# EAGLE schematic atmega8-evm-main (EAGLE 6.4)
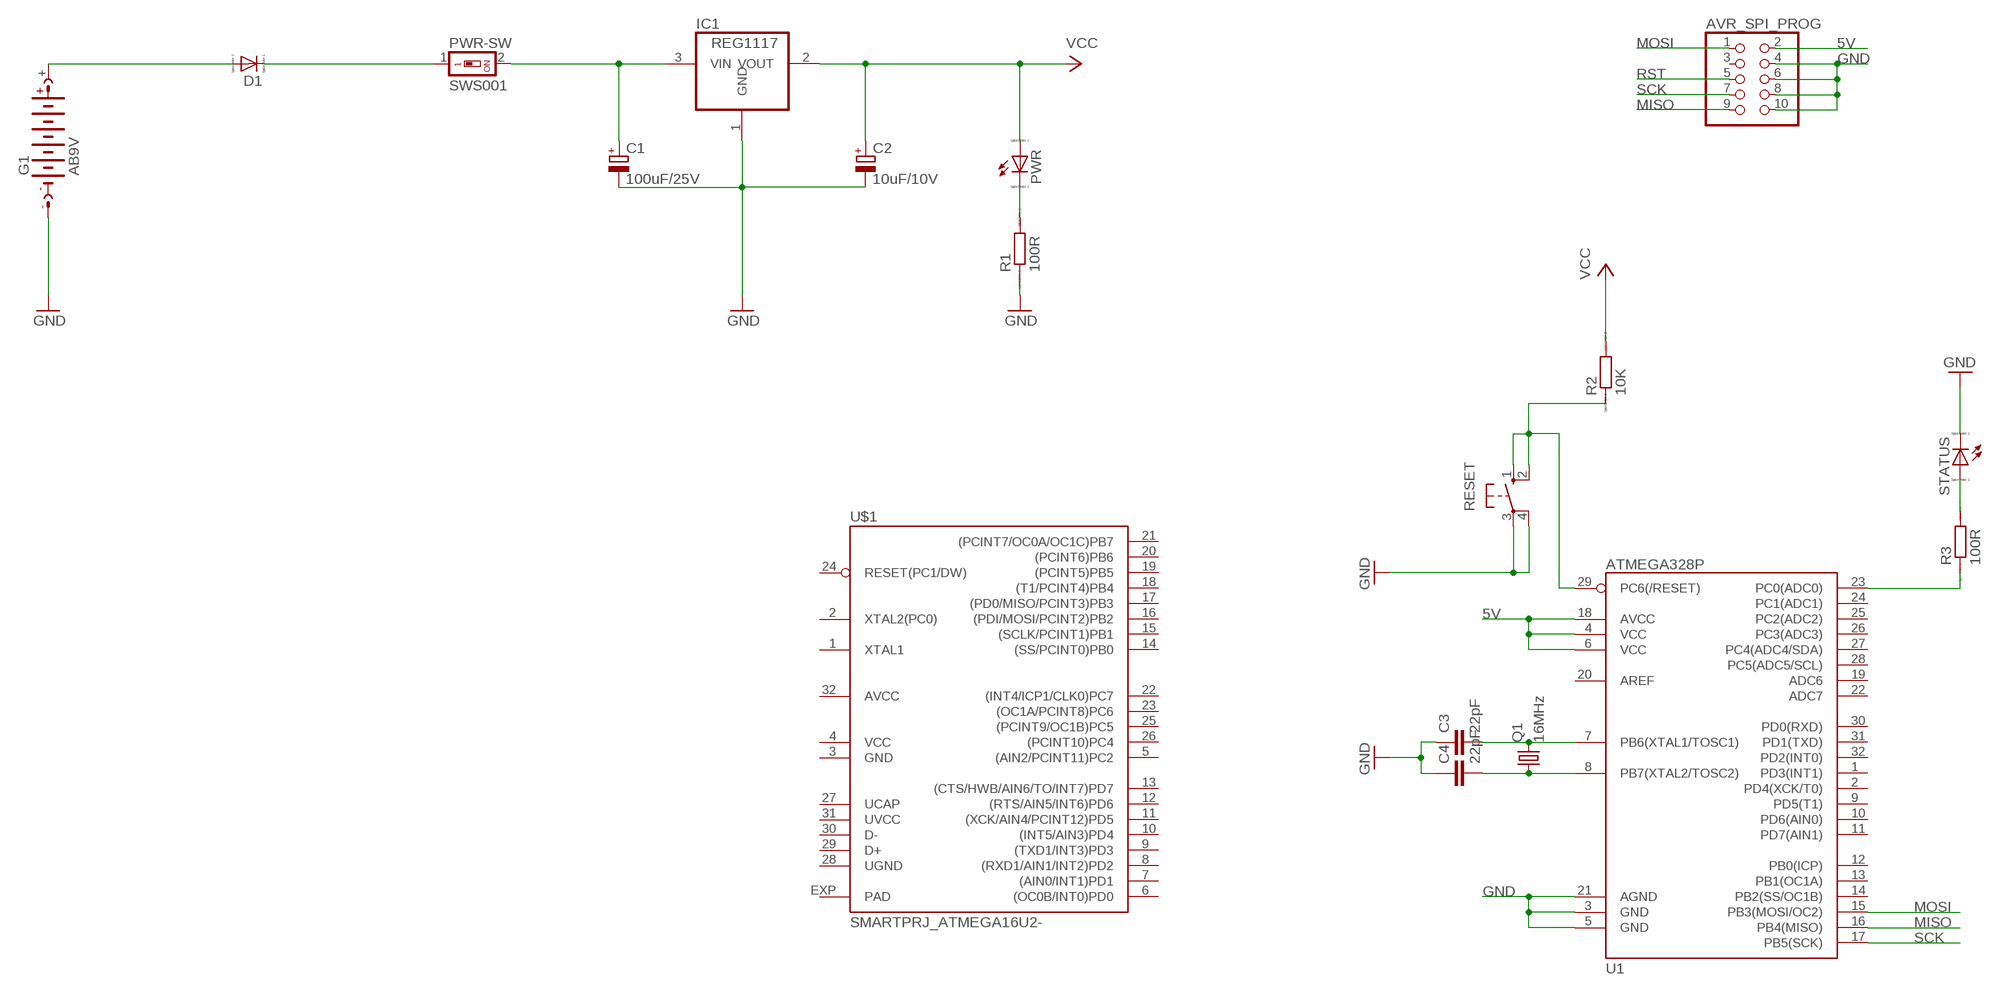
[diagram p0: schematic, sheet 1]

## Parts
AVR_SPI_PROG  PINHD-2X5  [2X05]
C1  100uF/25V  CPOL-EU085CS-1AR  [085CS_1AR]
C2  10uF/10V  CPOL-EU085CS-1AR  [085CS_1AR]
C3  22pF  C-EUC0805  [C0805]
C4  22pF  C-EUC0805  [C0805]
D1  DIODE_E-  [DIODE_SMB]
G1  AB9V  [AB9V]
IC1  REG1117  [SOT223]
PWR  LED_ESML0603  [LED_SML0603]
PWR-SW  SWS001  [SMS-001]
Q1  16MHz  CRYSTALCTS406  [CTS406]
R1  100R  R  [R0805]
R2  10K  R  [R0805]
R3  100R  R  [R0805]
RESET  40-XX  [B3F-40XX]
STATUS  LED_ESML0603  [LED_SML0603]
U1  ATMEGA328P  ATMEGA328_SMT  [TQFP32-08]
U$1  SMARTPRJ_ATMEGA16U2-  [SMARTPRJ_ATMEL_QFN32]

## Nets
GND: AVR_SPI_PROG.4 AVR_SPI_PROG.6 AVR_SPI_PROG.8 AVR_SPI_PROG.10 C1.- C2.- C3.1 C4.1 G1.- IC1.1(GND) R1.1 RESET.3(P) RESET.4(P1) STATUS.C U1.3(GND) U1.5(GND) U1.21(AGND)
MISO: AVR_SPI_PROG.9 U1.16(PB4(MISO))
MOSI: AVR_SPI_PROG.1 U1.15(PB3(MOSI/OC2))
N$1: D1.A(C) G1.+
N$2: D1.C(A) PWR-SW.1
N$3: C1.+ IC1.3(VIN) PWR-SW.2
N$4: PWR.C R1.2
N$5: R3.2 STATUS.A
N$6: R3.1 U1.23(PC0(ADC0))
N$7: C3.2 Q1.3 U1.7(PB6(XTAL1/TOSC1))
N$8: C4.2 Q1.1 U1.8(PB7(XTAL2/TOSC2))
RST: AVR_SPI_PROG.5 R2.1 RESET.1(S) RESET.2(S1) U1.29(PC6(/RESET))
SCK: AVR_SPI_PROG.7 U1.17(PB5(SCK))
VCC: AVR_SPI_PROG.2 C2.+ IC1.2(VOUT) PWR.A R2.2 U1.4(VCC) U1.6(VCC) U1.18(AVCC)
Unconnected: AVR_SPI_PROG.3 U1.1(PD3(INT1)) U1.2(PD4(XCK/T0)) U1.9(PD5(T1)) U1.10(PD6(AIN0)) U1.11(PD7(AIN1)) U1.12(PB0(ICP)) U1.13(PB1(OC1A)) U1.14(PB2(SS/OC1B)) U1.19(ADC6) U1.20(AREF) U1.22(ADC7) U1.24(PC1(ADC1)) U1.25(PC2(ADC2)) U1.26(PC3(ADC3)) U1.27(PC4(ADC4/SDA)) U1.28(PC5(ADC5/SCL)) U1.30(PD0(RXD)) U1.31(PD1(TXD)) U1.32(PD2(INT0)) U$1.1(XTAL1) U$1.2(XTAL2(PC0)) U$1.5((AIN2/PCINT11)PC2) U$1.6((OC0B/INT0)PD0) U$1.7((AIN0/INT1)PD1) U$1.8((RXD1/AIN1/INT2)PD2) U$1.9((TXD1/INT3)PD3) U$1.10((INT5/AIN3)PD4) U$1.11((XCK/AIN4/PCINT12)PD5) U$1.12((RTS/AIN5/INT6)PD6) U$1.13((CTS/HWB/AIN6/TO/INT7)PD7) U$1.14((SS/PCINT0)PB0) U$1.15((SCLK/PCINT1)PB1) U$1.16((PDI/MOSI/PCINT2)PB2) U$1.17((PD0/MISO/PCINT3)PB3) U$1.18((T1/PCINT4)PB4) U$1.19((PCINT5)PB5) U$1.20((PCINT6)PB6) U$1.21((PCINT7/OC0A/OC1C)PB7) U$1.22((INT4/ICP1/CLK0)PC7) U$1.23((OC1A/PCINT8)PC6) U$1.24(RESET(PC1/DW)) U$1.25((PCINT9/OC1B)PC5) U$1.26((PCINT10)PC4) U$1.27(UCAP) U$1.29(D+) U$1.30(D-)

## Notes on the sheet
- MOSI | 5V
- GND
- RST
- SCK
- MISO
- 5V
- GND
- MOSI
- MISO
- SCK

## Power pins joined to a net without a drawn wire
AVCC: U$1.32(AVCC)
GND: U$1.3(GND)
PAD: U$1.EXP(PAD)
UGND: U$1.28(UGND)
UVCC: U$1.31(UVCC)
VCC: U$1.4(VCC)

## Library data of the parts
AVR_SPI_PROG = pinhead:PINHD-2X5: PIN HEADER
C1 C2 = resistor:CPOL-EU: POLARIZED CAPACITOR, European symbol
C3 C4 = rcl:C-EU: CAPACITOR, European symbol
D1 = eagle-ltspice:DIODE_E-: Schottky Diode; SPICEMODEL: diode; SPICEPREFIX: D
G1 = battery:AB9V: 9-V BATTERY CLIP
IC1 = burr-brown:REG1117: 800mA and 1A Low Dropout (LDO) Positive Regulator 1.8V, 2.5V, 2.85V, 3.3V, 5V, and Adj; MPN: REG1117; OC_FARNELL: 1097566; OC_NEWARK: 14P6981
PWR STATUS = eagle-ltspice:LED_E: LED Source: http://www.osram.convergy.de Source: www.luxeon.com Source: www.kingbright.com; SPICEMODEL: NONE; SPICEPREFIX: D; SPICETYPE: diode
PWR-SW = smd-special:SWS001: SMD Dip Switch 1 pol.
Q1 = crystal:CRYSTAL: CRYSTAL; OC_FARNELL: unknown; OC_NEWARK: unknown
R1-R3 = eagle-ltspice:R: RESISTOR, European symbol; SPICEMODEL: NONE; SPICEPREFIX: R
RESET = switch-omron:40-XX: OMRON SWITCH; MF: OMRON COMPONENTS USA; MPN: B3F-4000; OC_FARNELL: 176434; OC_NEWARK: 36K3105
U1 = SparkFun-DigitalIC:ATMEGA328_SMT: 32-Pin Atmega328 part Commonly used on Arduino compatible boards Available in QFP and QFN packages TQFP is IC-09069 QFN is non-stock; PROD_ID: IC-09069
U$1 = arduino_Uno_Rev3-02-TH:SMARTPRJ_ATMEGA16U2-